# Altium schematic sheet Top Sheet.SchDoc
size A; DocumentNumber: 1; SheetNumber: 1; SheetTotal: 30
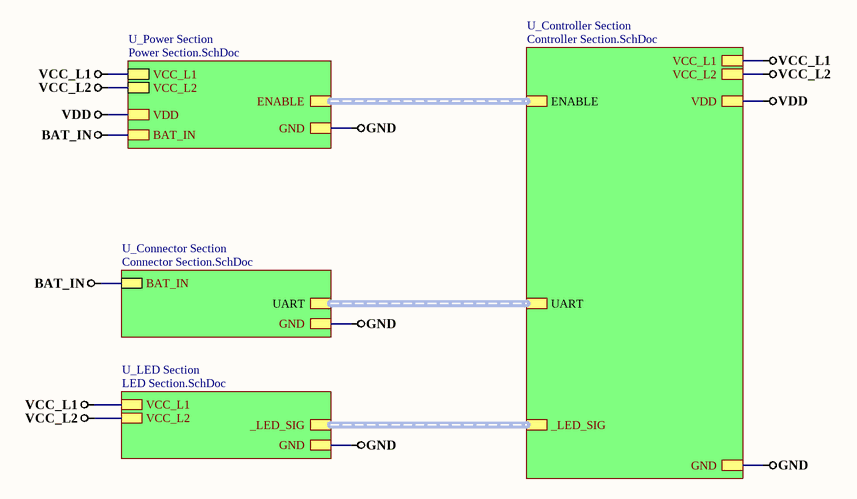
[diagram p0: Top Sheet.SchDoc]

## Sub-sheets
U_Connector Section = Connector Section.SchDoc: UART (harness Harness), BAT_IN, GND
U_Controller Section = Controller Section.SchDoc: ENABLE (harness Harness_2), UART (harness Harness), VCC_L2, VCC_L1, VDD, GND, _LED_SIG (harness Harness_8)
U_LED Section = LED Section.SchDoc: GND, VCC_L2, VCC_L1, _LED_SIG (harness Harness_8)
U_Power Section = Power Section.SchDoc: VCC_L1, VCC_L2, VDD, GND, ENABLE (harness Harness_2), BAT_IN

## Nets
BAT_IN: sheet U_Power Section/BAT_IN, sheet U_Connector Section/BAT_IN
GND: sheet U_LED Section/GND, sheet U_Power Section/GND, sheet U_Controller Section/GND, sheet U_Connector Section/GND
VCC_L1: sheet U_LED Section/VCC_L1, sheet U_Power Section/VCC_L1, sheet U_Controller Section/VCC_L1
VCC_L2: sheet U_LED Section/VCC_L2, sheet U_Power Section/VCC_L2, sheet U_Controller Section/VCC_L2
VDD: sheet U_Power Section/VDD, sheet U_Controller Section/VDD

## Buses and harness runs
harness sheet U_Connector Section/UART = sheet U_Controller Section/UART
harness sheet U_Controller Section/_LED_SIG = sheet U_LED Section/_LED_SIG
harness sheet U_Controller Section/ENABLE = sheet U_Power Section/ENABLE